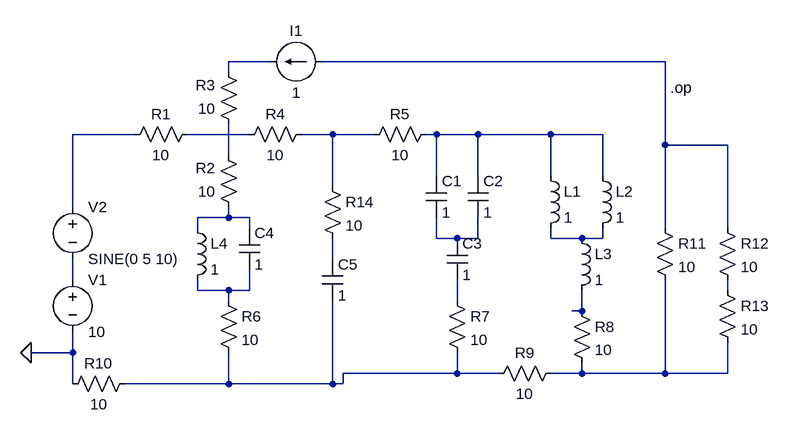
[diagram p0: schematic BIGtest-op.asc]
BIGtest-op.asc, the LTspice schematic file:
Version 4
SHEET 1 1044 680
WIRE 272 64 208 64
WIRE 880 64 352 64
WIRE 208 80 208 64
WIRE 64 176 -32 176
WIRE 240 176 144 176
WIRE 368 176 320 176
WIRE 432 176 368 176
WIRE 528 176 512 176
WIRE 592 176 528 176
WIRE 704 176 592 176
WIRE 784 176 704 176
WIRE 880 192 880 64
WIRE 976 192 880 192
WIRE 208 208 208 160
WIRE 528 240 528 176
WIRE 592 240 592 176
WIRE 704 240 704 176
WIRE 784 240 784 176
WIRE 368 256 368 176
WIRE -32 288 -32 176
WIRE 208 304 208 288
WIRE 208 304 160 304
WIRE 240 304 208 304
WIRE 160 320 160 304
WIRE 240 320 240 304
WIRE 880 320 880 192
WIRE 976 320 976 192
WIRE 528 336 528 304
WIRE 560 336 528 336
WIRE 592 336 592 304
WIRE 592 336 560 336
WIRE 704 336 704 320
WIRE 752 336 704 336
WIRE 784 336 784 320
WIRE 784 336 752 336
WIRE 368 368 368 336
WIRE -32 400 -32 368
WIRE 160 416 160 400
WIRE 208 416 160 416
WIRE 240 416 240 384
WIRE 240 416 208 416
WIRE 976 416 976 400
WIRE 208 432 208 416
WIRE 560 432 560 400
WIRE 752 448 752 416
WIRE 752 448 736 448
WIRE -32 512 -32 480
WIRE -32 512 -96 512
WIRE 560 544 560 512
WIRE 560 544 384 544
WIRE 624 544 560 544
WIRE 752 544 752 528
WIRE 752 544 704 544
WIRE 880 544 880 400
WIRE 880 544 752 544
WIRE 976 544 976 496
WIRE 976 544 880 544
WIRE -32 560 -32 512
WIRE 208 560 208 512
WIRE 208 560 48 560
WIRE 368 560 368 432
WIRE 368 560 208 560
WIRE 384 560 384 544
WIRE 384 560 368 560
FLAG -96 512 0
FLAG -96 512 0
SYMBOL voltage -32 384 R0
SYMATTR InstName V1
SYMATTR Value 10
SYMBOL voltage -32 272 R0
SYMATTR InstName V2
SYMATTR Value SINE(0 5 10)
SYMBOL res 160 160 R90
WINDOW 0 0 56 VBottom 2
WINDOW 3 32 56 VTop 2
SYMATTR InstName R1
SYMATTR Value 10
SYMBOL res 224 304 R180
WINDOW 0 36 76 Left 2
WINDOW 3 36 40 Left 2
SYMATTR InstName R2
SYMATTR Value 10
SYMBOL res 224 176 R180
WINDOW 0 36 76 Left 2
WINDOW 3 36 40 Left 2
SYMATTR InstName R3
SYMATTR Value 10
SYMBOL res 224 192 R270
WINDOW 0 32 56 VTop 2
WINDOW 3 0 56 VBottom 2
SYMATTR InstName R4
SYMATTR Value 10
SYMBOL res 416 192 R270
WINDOW 0 32 56 VTop 2
WINDOW 3 0 56 VBottom 2
SYMATTR InstName R5
SYMATTR Value 10
SYMBOL cap 512 240 R0
SYMATTR InstName C1
SYMATTR Value 1
SYMBOL cap 576 240 R0
SYMATTR InstName C2
SYMATTR Value 1
SYMBOL cap 544 336 R0
SYMATTR InstName C3
SYMATTR Value 1
SYMBOL ind 688 224 R0
SYMATTR InstName L1
SYMATTR Value 1
SYMBOL ind 768 224 R0
SYMATTR InstName L2
SYMATTR Value 1
SYMBOL ind 736 320 R0
SYMATTR InstName L3
SYMATTR Value 1
SYMBOL ind 144 304 R0
SYMATTR InstName L4
SYMATTR Value 1
SYMBOL cap 224 320 R0
SYMATTR InstName C4
SYMATTR Value 1
SYMBOL res 192 416 R0
SYMATTR InstName R6
SYMATTR Value 10
SYMBOL res 544 416 R0
SYMATTR InstName R7
SYMATTR Value 10
SYMBOL res 736 432 R0
SYMATTR InstName R8
SYMATTR Value 10
SYMBOL res 720 528 R90
WINDOW 0 0 56 VBottom 2
WINDOW 3 32 56 VTop 2
SYMATTR InstName R9
SYMATTR Value 10
SYMBOL current 352 64 R90
WINDOW 0 -32 40 VBottom 2
WINDOW 3 32 40 VTop 2
SYMATTR InstName I1
SYMATTR Value 1
SYMBOL res 64 544 R90
WINDOW 0 0 56 VBottom 2
WINDOW 3 32 56 VTop 2
SYMATTR InstName R10
SYMATTR Value 10
SYMBOL res 864 304 R0
SYMATTR InstName R11
SYMATTR Value 10
SYMBOL res 960 304 R0
SYMATTR InstName R12
SYMATTR Value 10
SYMBOL res 960 400 R0
SYMATTR InstName R13
SYMATTR Value 10
SYMBOL res 352 240 R0
SYMATTR InstName R14
SYMATTR Value 10
SYMBOL cap 352 368 R0
SYMATTR InstName C5
SYMATTR Value 1
TEXT 888 104 Left 2 !.op

The netlist it stands for:
* BIGtest-op.asc
V1 N012 0 10
V2 N003 N012 SINE(0 5 10)
R1 N004 N003 10
R2 N008 N007 10
R3 N007 N001 10
R4 N004 N005 10
R5 N005 N006 10
C1 N006 N009 1
C2 N006 N009 1
C3 N009 N015 1
L1 N006 N010 1
L2 N006 N010 1
L3 N010 N016 1
L4 N008 N013 1
C4 N008 N013 1
R6 N013 N017 10
R7 N015 N017 10
R8 N016 N018 10
R9 N018 N017 10
I1 N002 N001 1
R10 N017 0 10
R11 N002 N018 10
R12 N002 N014 10
R13 N014 N018 10
R14 N005 N011 10
C5 N011 N017 1
.op
.backanno
.end